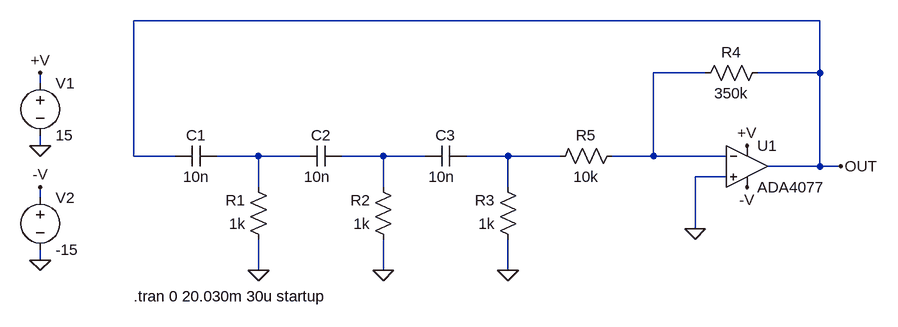
[diagram p0: schematic 04-rc-phase-shift-oscillator.asc]
04-rc-phase-shift-oscillator.asc, the LTspice schematic file:
Version 4.1
SHEET 1 896 1108
WIRE 480 176 -576 176
WIRE 304 256 224 256
WIRE 480 256 480 176
WIRE 480 256 384 256
WIRE -720 272 -720 256
WIRE -720 368 -720 352
WIRE -576 384 -576 176
WIRE -512 384 -576 384
WIRE -384 384 -448 384
WIRE -320 384 -384 384
WIRE -192 384 -256 384
WIRE -128 384 -192 384
WIRE 0 384 -64 384
WIRE 80 384 0 384
WIRE 224 384 224 256
WIRE 224 384 160 384
WIRE 336 384 224 384
WIRE 480 400 480 256
WIRE 480 400 400 400
WIRE 512 400 480 400
WIRE 336 416 288 416
WIRE -384 432 -384 384
WIRE -192 432 -192 384
WIRE 0 432 0 384
WIRE -720 448 -720 432
WIRE 288 496 288 416
WIRE -720 544 -720 528
WIRE -384 560 -384 512
WIRE -192 560 -192 512
WIRE 0 560 0 512
FLAG 368 368 +V
FLAG 368 432 -V
FLAG -720 256 +V
FLAG -720 544 0
FLAG -720 368 0
FLAG -720 432 -V
FLAG -384 560 0
FLAG 512 400 OUT
FLAG 288 496 0
FLAG -192 560 0
FLAG 0 560 0
SYMBOL voltage -720 256 R0
SYMATTR InstName V1
SYMATTR Value 15
SYMBOL voltage -720 432 R0
SYMATTR InstName V2
SYMATTR Value -15
SYMBOL res -368 528 R180
WINDOW 0 36 76 Left 2
WINDOW 3 36 40 Left 2
SYMATTR InstName R1
SYMATTR Value 1k
SYMBOL cap -256 368 R90
WINDOW 0 0 32 VBottom 2
WINDOW 3 32 38 VTop 2
SYMATTR InstName C2
SYMATTR Value 10n
SYMBOL res -176 528 R180
WINDOW 0 36 76 Left 2
WINDOW 3 36 40 Left 2
SYMATTR InstName R2
SYMATTR Value 1k
SYMBOL cap -448 368 R90
WINDOW 0 0 32 VBottom 2
WINDOW 3 32 32 VTop 2
SYMATTR InstName C1
SYMATTR Value 10n
SYMBOL cap -64 368 R90
WINDOW 0 0 32 VBottom 2
WINDOW 3 32 38 VTop 2
SYMATTR InstName C3
SYMATTR Value 10n
SYMBOL res 288 272 R270
WINDOW 0 32 56 VTop 2
WINDOW 3 0 56 VBottom 2
SYMATTR InstName R4
SYMATTR Value 350k
SYMBOL res 64 400 R270
WINDOW 0 32 56 VTop 2
WINDOW 3 0 56 VBottom 2
SYMATTR InstName R5
SYMATTR Value 10k
SYMBOL res 16 528 R180
WINDOW 0 36 76 Left 2
WINDOW 3 36 40 Left 2
SYMATTR InstName R3
SYMATTR Value 1k
SYMBOL OpAmps\\ADA4077 368 336 R0
SYMATTR InstName U1
TEXT -576 600 Left 2 !.tran 0 20.030m 30u startup

The netlist it stands for:
* 04-rc-phase-shift-oscillator.asc
V1 +V 0 15
V2 -V 0 -15
R1 0 N002 1k
C2 N003 N002 10n
R2 0 N003 1k
C1 N002 OUT 10n
C3 N004 N003 10n
R4 N001 OUT 350k
R5 N004 N001 10k
R3 0 N004 1k
X§U1 0 N001 +V -V OUT ADA4077  ; pins In+ In- V+ V- OUT
.tran 0 20.030m 30u startup
.backanno
.end